# Altium project CAMERA_V100.PrjPcb
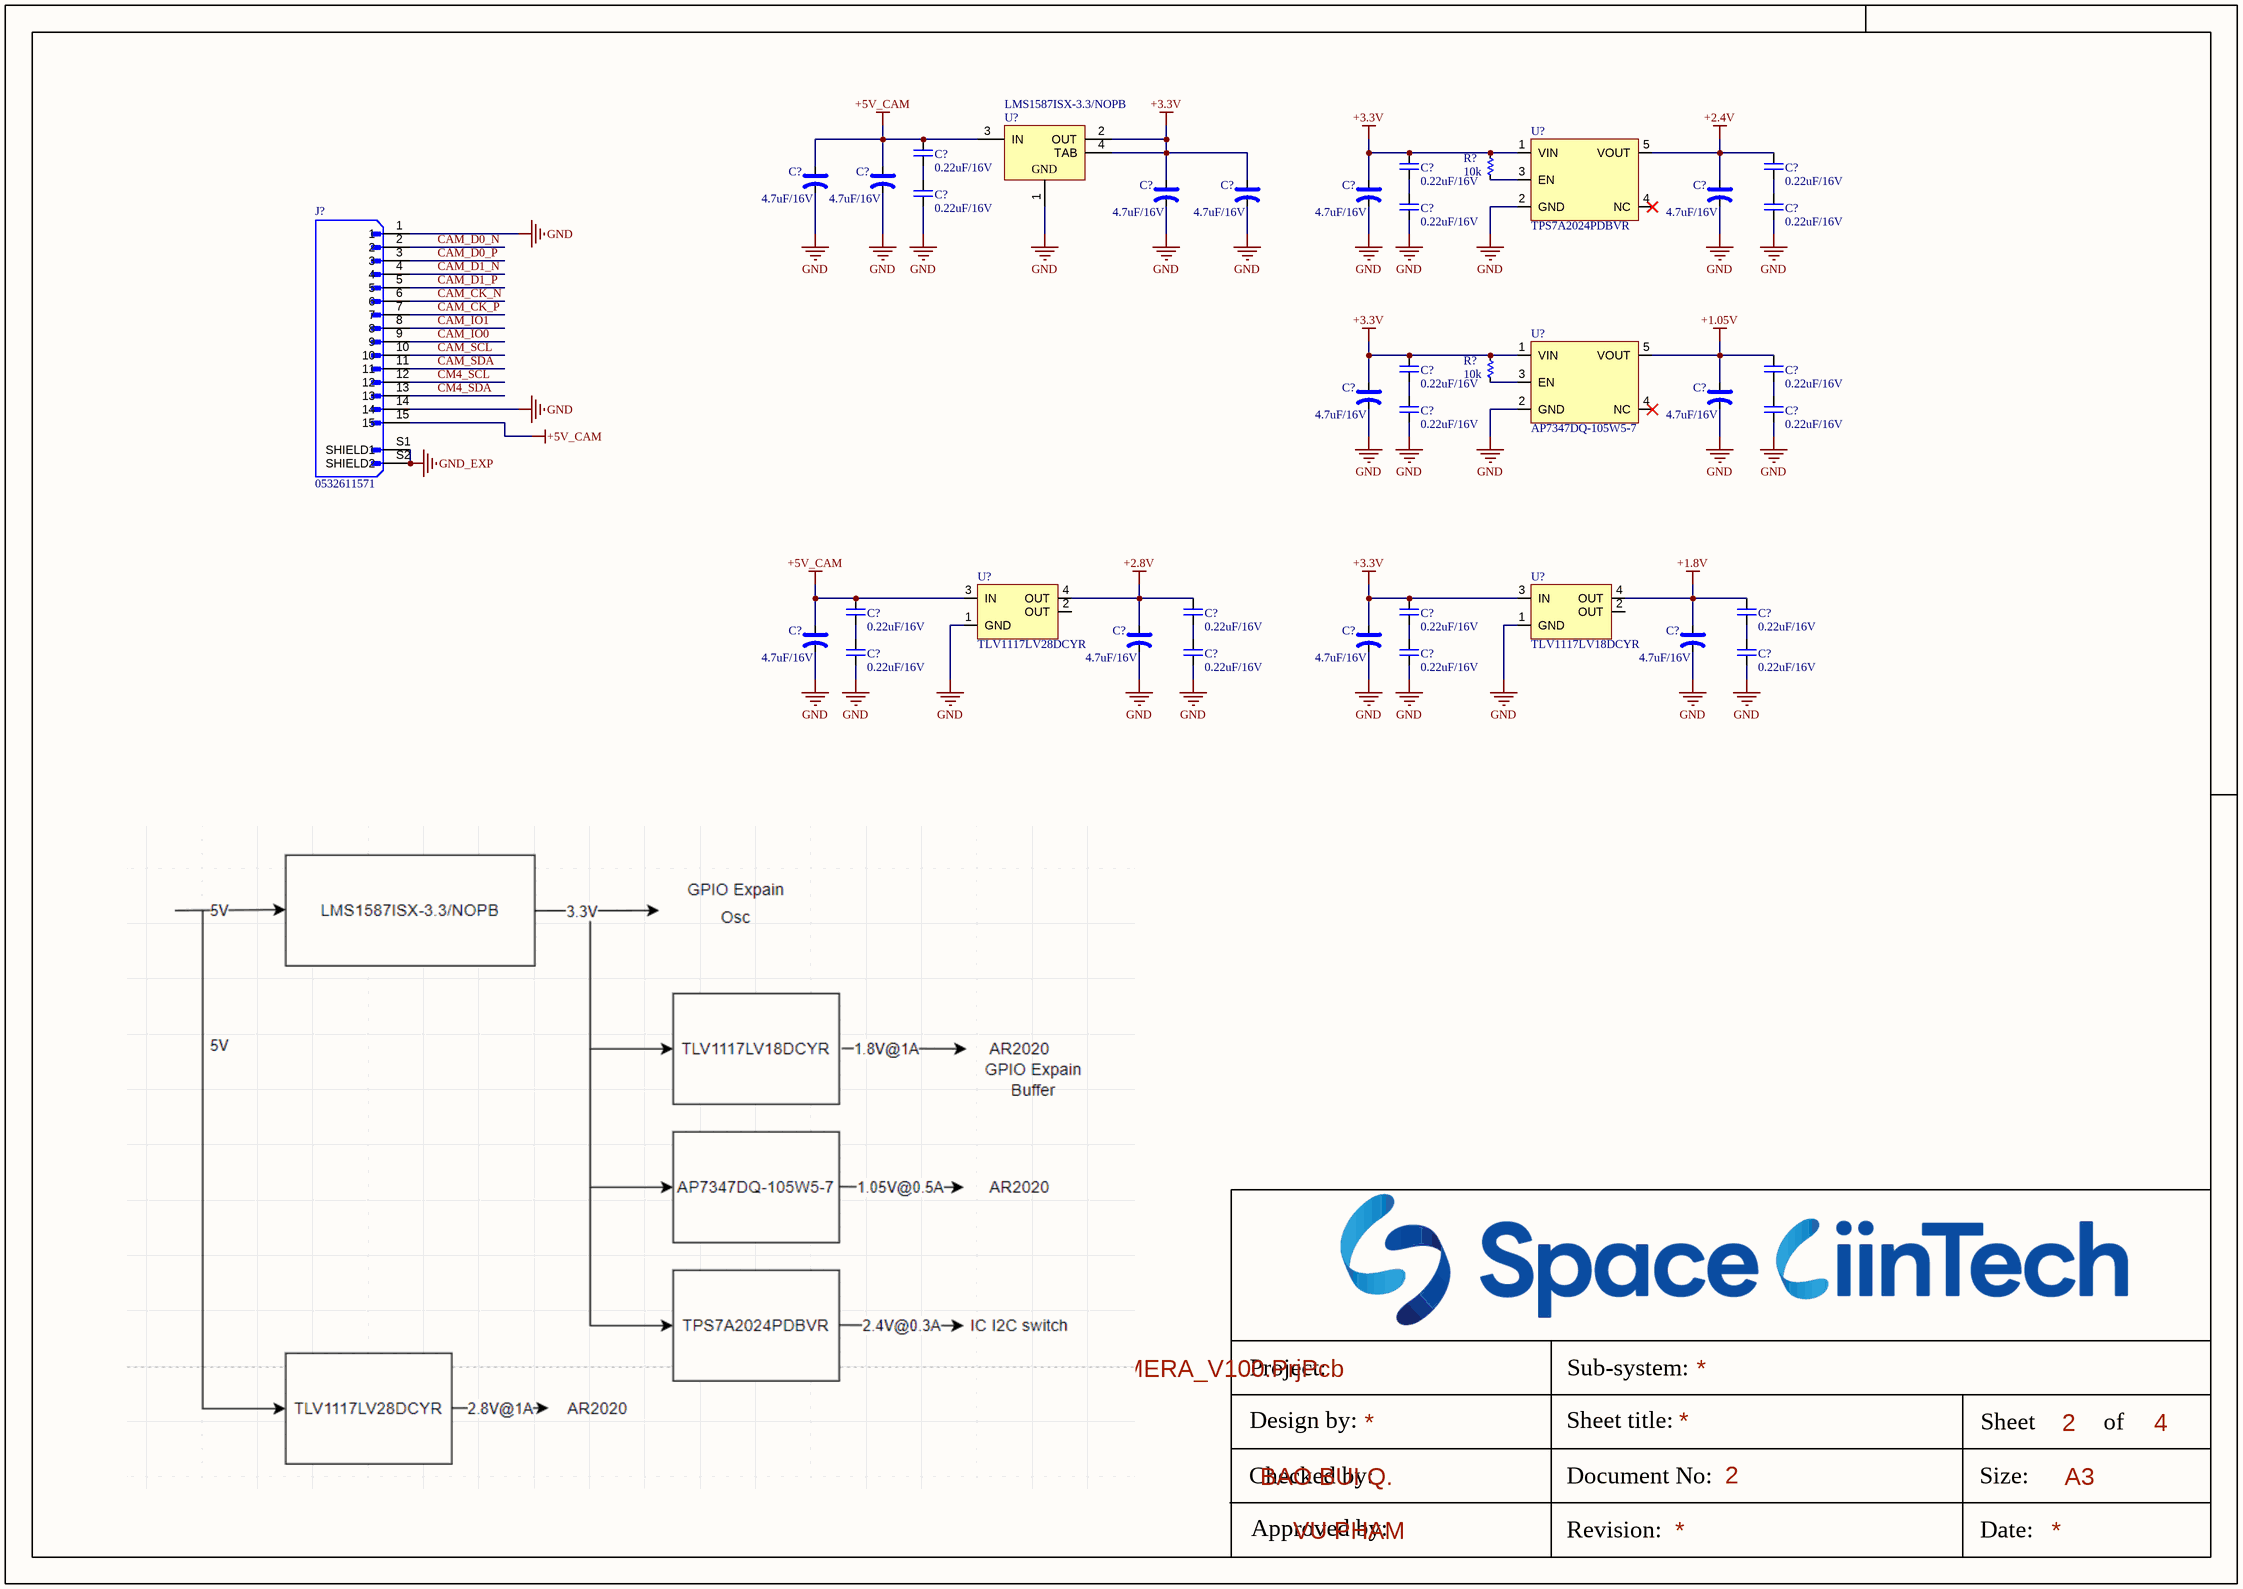
[diagram p0: CONNECTOR.SchDoc]
3 sheets, 167 parts. Net scope: global (net labels, ports and power ports of the same name join across sheets).
Board file: CAMERA_V100.PcbDoc
Sheets:
  CONNECTOR.SchDoc
  POWER.SchDoc
  SENSOR.SchDoc

## Sheet CONNECTOR.SchDoc
size 420 x 297 mm; SheetNumber: 2; SheetTotal: 4

### Parts
(Parts that share a designator on the sheet are numbered #1, #2 ... from top to bottom, then left to right.)
C?#1  0.22uF/16V
C?#2  0.22uF/16V
C?#3  0.22uF/16V
C?#4  4.7uF/16V
C?#5  4.7uF/16V
C?#6  0.22uF/16V
C?#7  4.7uF/16V
C?#8  4.7uF/16V
C?#9  4.7uF/16V
C?#10  4.7uF/16V
C?#11  0.22uF/16V
C?#12  0.22uF/16V
C?#13  0.22uF/16V
C?#14  0.22uF/16V
C?#15  4.7uF/16V
C?#16  4.7uF/16V
C?#17  0.22uF/16V
C?#18  0.22uF/16V
C?#19  0.22uF/16V
C?#20  0.22uF/16V
C?#21  0.22uF/16V
C?#22  0.22uF/16V
C?#23  4.7uF/16V
C?#24  4.7uF/16V
C?#25  4.7uF/16V
C?#26  4.7uF/16V
C?#27  0.22uF/16V
C?#28  0.22uF/16V
C?#29  0.22uF/16V
C?#30  0.22uF/16V
J?  0532611571  [0532611571]
R?#1  10k
R?#2  10k
U?#1  LMS1587ISX-3.3/NOPB  [TS3B_L]
U?#2  TPS7A2024PDBVR
U?#3  AP7347DQ-105W5-7
U?#4  TLV1117LV28DCYR
U?#5  TLV1117LV18DCYR

### Nets
+1.05V: C?#14.2 C?#16.1 U?#3.5(VOUT)
+1.8V: C?#22.2 C?#26.1 U?#5.4(OUT)
+2.4V: C?#3.2 C?#10.1 U?#2.5(VOUT)
+2.8V: C?#20.2 C?#24.1 U?#4.4(OUT)
+3.3V: C?#2.2 C?#7.1 C?#8.1 C?#9.1 C?#13.2 C?#15.1 C?#21.2 C?#25.1 R?#1.2 R?#2.2 U?#1.2(OUT) U?#1.4(TAB) U?#2.1(VIN) U?#3.1(VIN) U?#5.3(IN)
+5V_CAM: C?#1.2 C?#4.1 C?#5.1 C?#19.2 C?#23.1 J?.15 U?#1.3(IN) U?#4.3(IN)
GND: C?#4.2 C?#5.2 C?#6.1 C?#7.2 C?#8.2 C?#9.2 C?#10.2 C?#11.1 C?#12.1 C?#15.2 C?#16.2 C?#17.1 C?#18.1 C?#23.2 C?#24.2 C?#25.2 C?#26.2 C?#27.1 C?#28.1 C?#29.1 C?#30.1 J?.1 J?.14 U?#1.1(GND) U?#2.2(GND) U?#3.2(GND) U?#4.1(GND) U?#5.1(GND)
GND_EXP: J?.S1(SHIELD1) J?.S2(SHIELD2)
CAM_CK_N: J?.6
CAM_CK_P: J?.7
CAM_D0_N: J?.2
CAM_D0_P: J?.3
CAM_D1_N: J?.4
CAM_D1_P: J?.5
CAM_IO0: J?.9
CAM_IO1: J?.8
CAM_SCL: J?.10
CAM_SDA: J?.11
CM4_SCL: J?.12
CM4_SDA: J?.13
NetC?#1_1: C?#1.1 C?#6.2
NetC?#2_1: C?#2.1 C?#11.2
NetC?#3_1: C?#3.1 C?#12.2
NetC?#13_1: C?#13.1 C?#17.2
NetC?#14_1: C?#14.1 C?#18.2
NetC?#19_1: C?#19.1 C?#27.2
NetC?#20_1: C?#20.1 C?#28.2
NetC?#21_1: C?#21.1 C?#29.2
NetC?#22_1: C?#22.1 C?#30.2
NetR?#1_1: R?#1.1 U?#2.3(EN)
NetR?#2_1: R?#2.1 U?#3.3(EN)

Not connected (* = marked no-connect by the designer): U?#2 4(NC)*; U?#3 4(NC)*; U?#4 2(OUT); U?#5 2(OUT)

### Notes on the sheet
- Project:
- Sub-system:
- Design by:
- BAO BUI Q.
- Sheet title:
- Sheet
- A3
- of
- Checked by:
- Approved by:
- VU PHAM
- Revision:
- Document No:
- Size:
- Date:

### Library data of the parts
C?#1-C?#3 C?#6 C?#11-C?#14 C?#17-C?#22 C?#27-C?#30 = CAP_SMD: CAP_Chip; Value: 33pF
C?#4 C?#5 C?#7-C?#10 C?#15 C?#16 C?#23-C?#26 = CAP_TH: CAP_Polarization; Published: 8-Jun-2000; LatestRevisionDate: 17-Jul-2002; LatestRevisionNote: Re-released for DXP Platform.; PackageReference: POLAR0.8; Publisher: Altium Limited
J? = CONN_SMD_15: Conn Shrouded Header (4 Sides) HDR 15 POS 1.25mm Solder RA Side Entry SMD PicoBladeâ„¢ T/R; MF: Molex; Package: None; MP: 532611571; Check_prices: https://www.snapeda.com/parts/532611571/Molex/view-part/?ref=eda; Purchase-URL: https://pricing.snapeda.com/search/part/532611571/?ref=eda; Value: *; Availability: In Stock; Price: None; SnapEDA_Link: https://www.snapeda.com/parts/532611571/Molex/view-part/?ref=snap
R?#1 R?#2 = RES-SMD: RES-Chip; Manufacturer: Generic Components; Class: Passive; Published: 08/06/2000; Publisher: Altium Hobart Technology Centre
U?#1 = CMP-0062-00180-3: 3A Low Dropout Fast Response Regulators, 3-pin TO-263, Pb-Free; Manufacturer: National Semiconductor; PowerWise: N; High-Reliability: Y; PackageTopMarking: NSUZXYTTE#*LMS1587*IS-3.3; CompType: LDO IC; ComponentLink1Description: Manufacturer URL; PackageReference: TS3B; ComponentLink1URL: http://www.national.com/; ComponentLink2URL: http://www.national.com/ds/LM/LMS1587.pdf; DatasheetVersion: Jun-2005; ComponentLink3URL: http://www.national.com/pf/LM/LMS1587.html; PartNumber: LMS1587ISX-3.3/NOPB; RevisionNote: SCH symbol layout adjusted; PinCount: 3; RoHS: Y; Code_JEDEC: MO-169-AA; PackageDescription: TO-263, Molded, .400 x .390 x .180in, 3 Lead, .1in Pitch, Surface Mount; ComponentLink4Description: TS3B Package Page; ComponentLink3Description: LMS1587 Web Page; PackageVersion: revF, Apr-2005; ComponentLink2Description: LMS1587 Datasheet; ComponentLink4URL: http://www.national.com/packaging/folders/ts3b.html
U?#2 U?#3 = IC_POWER_AP7347DQ
U?#4 U?#5 = IC_POWER_TLV1117LV

## Sheet POWER.SchDoc
size 420 x 297 mm; SheetNumber: 3; SheetTotal: 4
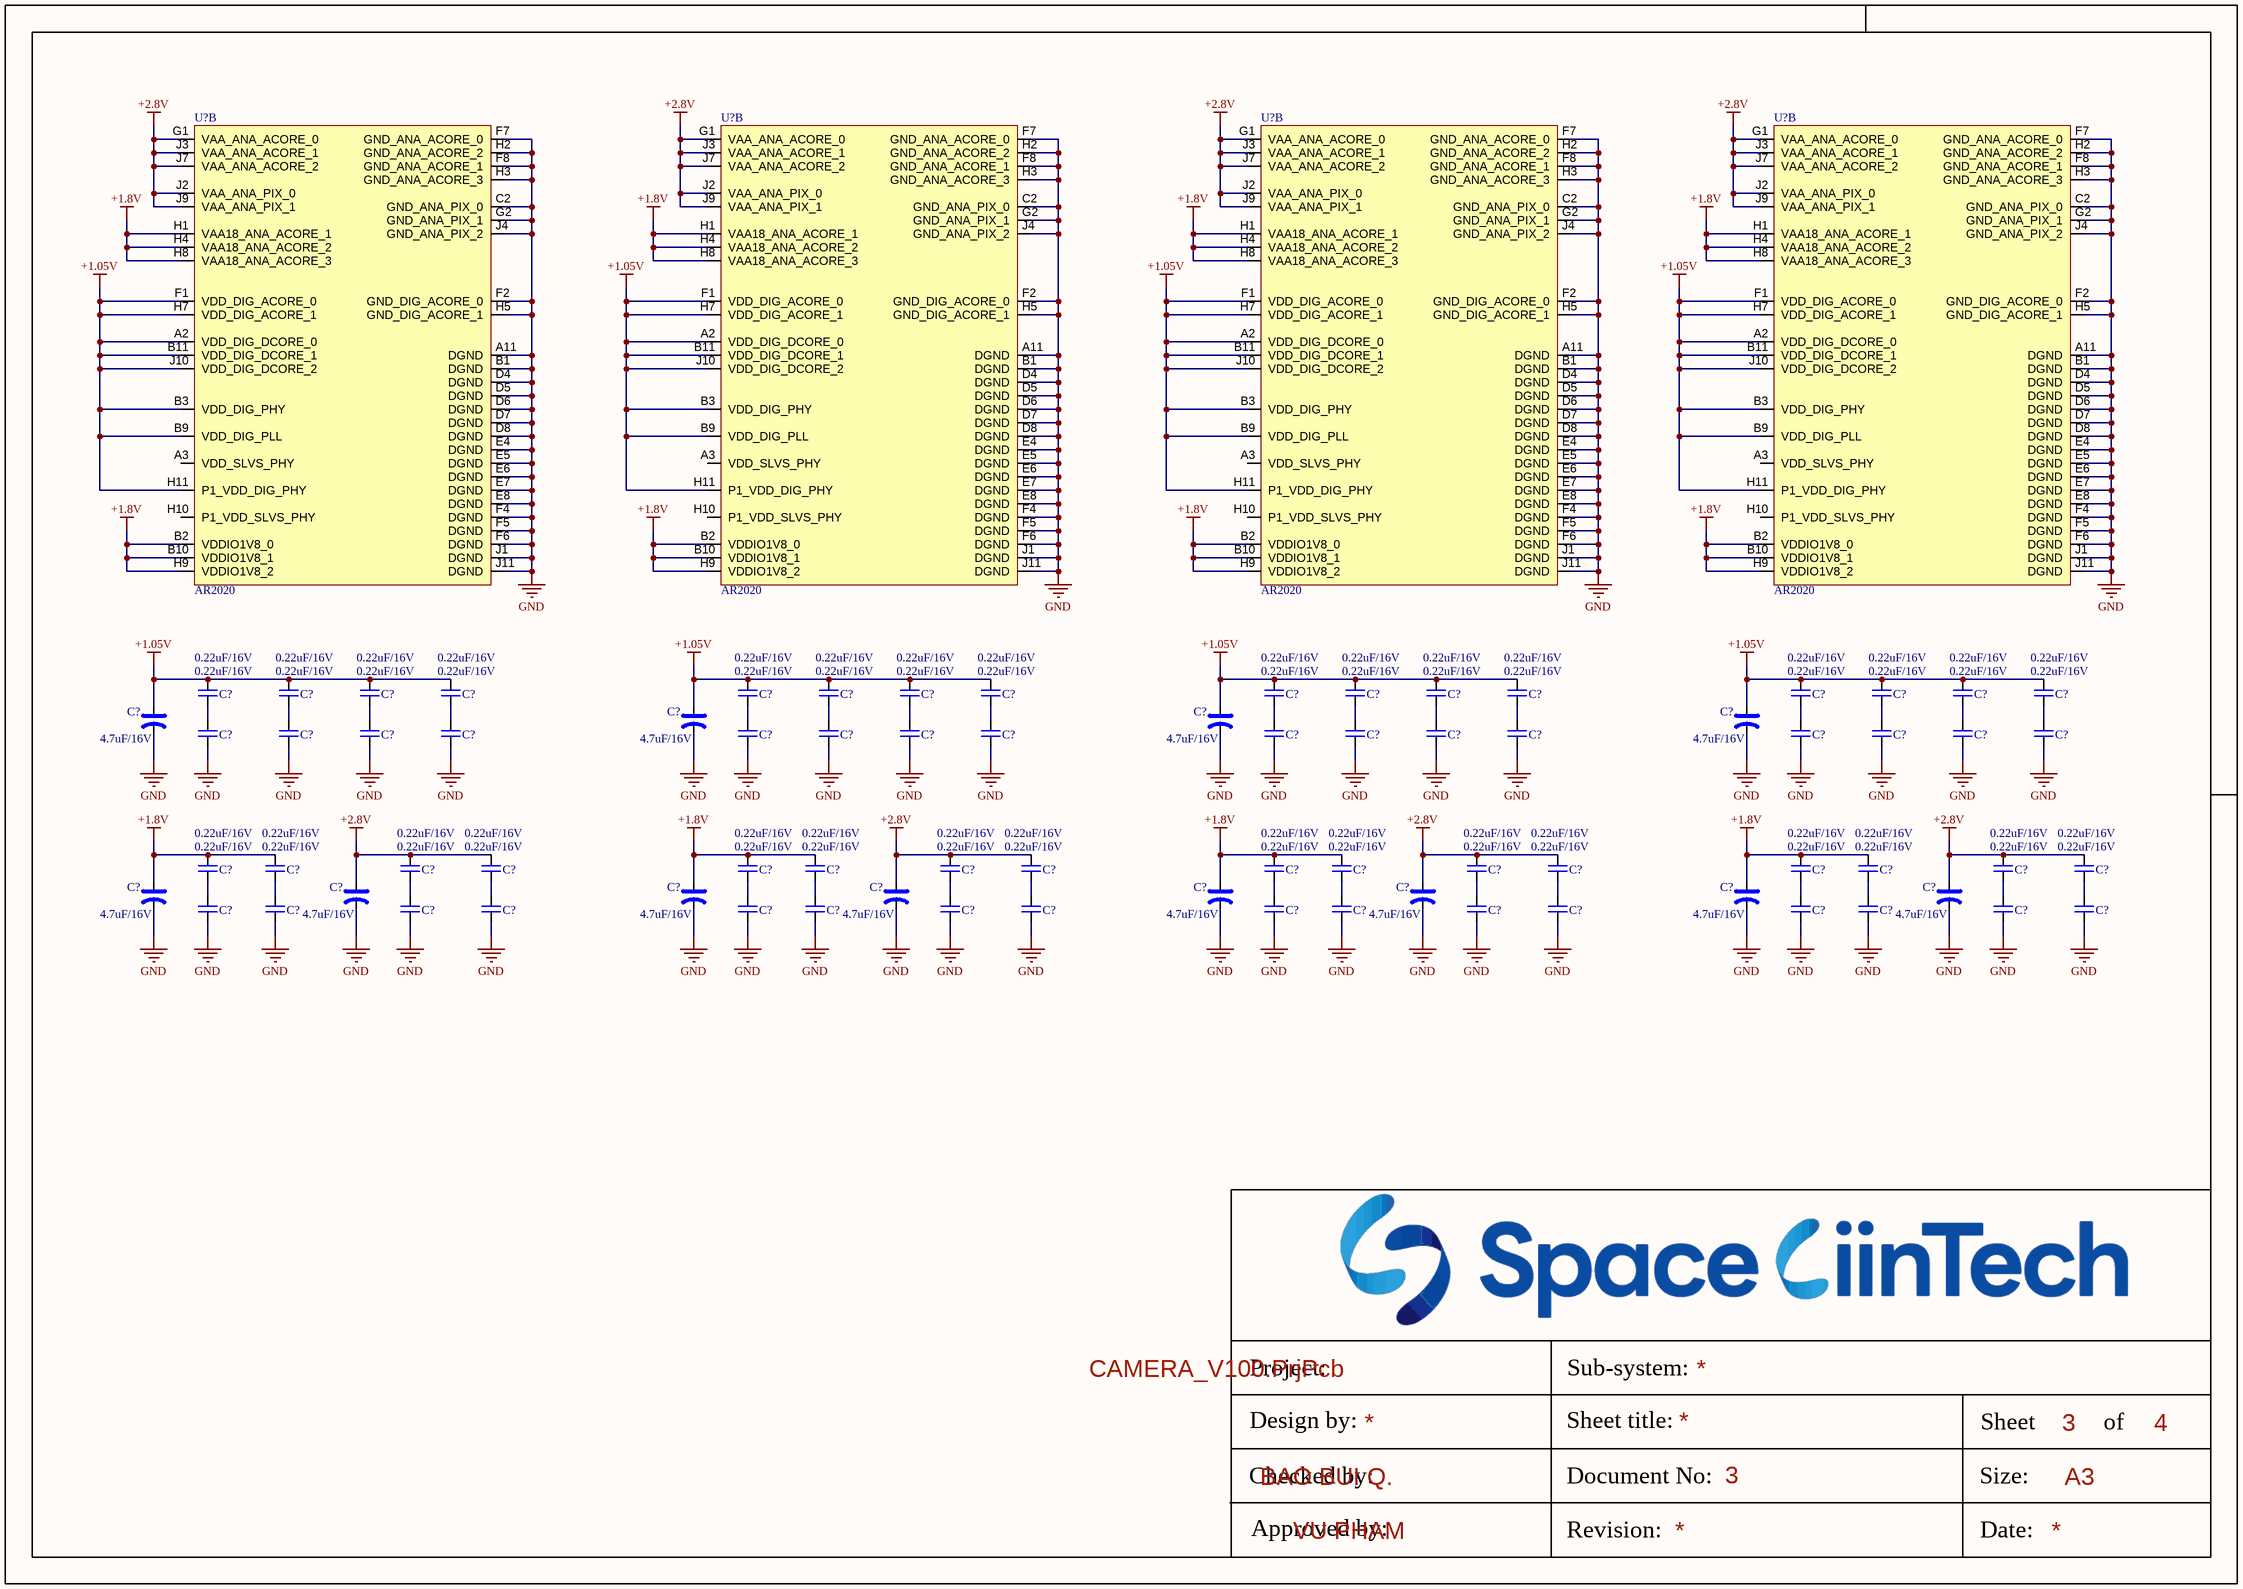
[diagram p1: POWER.SchDoc]

### Parts
(Parts that share a designator on the sheet are numbered #1, #2 ... from top to bottom, then left to right.)
C?#31  0.22uF/16V
C?#32  0.22uF/16V
C?#33  0.22uF/16V
C?#34  0.22uF/16V
C?#35  0.22uF/16V
C?#36  0.22uF/16V
C?#37  0.22uF/16V
C?#38  0.22uF/16V
C?#39  0.22uF/16V
C?#40  0.22uF/16V
C?#41  0.22uF/16V
C?#42  0.22uF/16V
C?#43  0.22uF/16V
C?#44  0.22uF/16V
C?#45  0.22uF/16V
C?#46  0.22uF/16V
C?#47  4.7uF/16V
C?#48  4.7uF/16V
C?#49  4.7uF/16V
C?#50  4.7uF/16V
C?#51  0.22uF/16V
C?#52  0.22uF/16V
C?#53  0.22uF/16V
C?#54  0.22uF/16V
C?#55  0.22uF/16V
C?#56  0.22uF/16V
C?#57  0.22uF/16V
C?#58  0.22uF/16V
C?#59  0.22uF/16V
C?#60  0.22uF/16V
C?#61  0.22uF/16V
C?#62  0.22uF/16V
C?#63  0.22uF/16V
C?#64  0.22uF/16V
C?#65  0.22uF/16V
C?#66  0.22uF/16V
C?#67  0.22uF/16V
C?#68  0.22uF/16V
C?#69  0.22uF/16V
C?#70  0.22uF/16V
C?#71  0.22uF/16V
C?#72  0.22uF/16V
C?#73  0.22uF/16V
C?#74  0.22uF/16V
C?#75  0.22uF/16V
C?#76  0.22uF/16V
C?#77  0.22uF/16V
C?#78  0.22uF/16V
C?#79  0.22uF/16V
C?#80  0.22uF/16V
C?#81  0.22uF/16V
C?#82  0.22uF/16V
C?#83  4.7uF/16V
C?#84  4.7uF/16V
C?#85  4.7uF/16V
C?#86  4.7uF/16V
C?#87  4.7uF/16V
C?#88  4.7uF/16V
C?#89  4.7uF/16V
C?#90  4.7uF/16V
C?#91  0.22uF/16V
C?#92  0.22uF/16V
C?#93  0.22uF/16V
C?#94  0.22uF/16V
C?#95  0.22uF/16V
C?#96  0.22uF/16V
C?#97  0.22uF/16V
C?#98  0.22uF/16V
C?#99  0.22uF/16V
C?#100  0.22uF/16V
C?#101  0.22uF/16V
C?#102  0.22uF/16V
C?#103  0.22uF/16V
C?#104  0.22uF/16V
C?#105  0.22uF/16V
C?#106  0.22uF/16V
U?#6  AR2020  (part B of 2)
U?#7  AR2020  (part B of 2)
U?#8  AR2020  (part B of 2)
U?#9  AR2020  (part B of 2)

### Nets
+1.05V: C?#31.2 C?#32.2 C?#33.2 C?#34.2 C?#35.2 C?#36.2 C?#37.2 C?#38.2 C?#39.2 C?#40.2 C?#41.2 C?#42.2 C?#43.2 C?#44.2 C?#45.2 C?#46.2 C?#47.1 C?#48.1 C?#49.1 C?#50.1 U?#6.A2(VDD_DIG_DCORE_0) U?#6.B3(VDD_DIG_PHY) U?#6.B9(VDD_DIG_PLL) U?#6.B11(VDD_DIG_DCORE_1) U?#6.F1(VDD_DIG_ACORE_0) U?#6.H7(VDD_DIG_ACORE_1) U?#6.H11(P1_VDD_DIG_PHY) U?#6.J10(VDD_DIG_DCORE_2) U?#7.A2(VDD_DIG_DCORE_0) U?#7.B3(VDD_DIG_PHY) U?#7.B9(VDD_DIG_PLL) U?#7.B11(VDD_DIG_DCORE_1) U?#7.F1(VDD_DIG_ACORE_0) U?#7.H7(VDD_DIG_ACORE_1) U?#7.H11(P1_VDD_DIG_PHY) U?#7.J10(VDD_DIG_DCORE_2) U?#8.A2(VDD_DIG_DCORE_0) U?#8.B3(VDD_DIG_PHY) U?#8.B9(VDD_DIG_PLL) U?#8.B11(VDD_DIG_DCORE_1) U?#8.F1(VDD_DIG_ACORE_0) U?#8.H7(VDD_DIG_ACORE_1) U?#8.H11(P1_VDD_DIG_PHY) U?#8.J10(VDD_DIG_DCORE_2) U?#9.A2(VDD_DIG_DCORE_0) U?#9.B3(VDD_DIG_PHY) U?#9.B9(VDD_DIG_PLL) U?#9.B11(VDD_DIG_DCORE_1) U?#9.F1(VDD_DIG_ACORE_0) U?#9.H7(VDD_DIG_ACORE_1) U?#9.H11(P1_VDD_DIG_PHY) U?#9.J10(VDD_DIG_DCORE_2)
+1.8V: C?#67.2 C?#68.2 C?#71.2 C?#72.2 C?#75.2 C?#76.2 C?#79.2 C?#80.2 C?#83.1 C?#85.1 C?#87.1 C?#89.1 U?#6.B2(VDDIO1V8_0) U?#6.B10(VDDIO1V8_1) U?#6.H1(VAA18_ANA_ACORE_1) U?#6.H4(VAA18_ANA_ACORE_2) U?#6.H8(VAA18_ANA_ACORE_3) U?#6.H9(VDDIO1V8_2) U?#7.B2(VDDIO1V8_0) U?#7.B10(VDDIO1V8_1) U?#7.H1(VAA18_ANA_ACORE_1) U?#7.H4(VAA18_ANA_ACORE_2) U?#7.H8(VAA18_ANA_ACORE_3) U?#7.H9(VDDIO1V8_2) U?#8.B2(VDDIO1V8_0) U?#8.B10(VDDIO1V8_1) U?#8.H1(VAA18_ANA_ACORE_1) U?#8.H4(VAA18_ANA_ACORE_2) U?#8.H8(VAA18_ANA_ACORE_3) U?#8.H9(VDDIO1V8_2) U?#9.B2(VDDIO1V8_0) U?#9.B10(VDDIO1V8_1) U?#9.H1(VAA18_ANA_ACORE_1) U?#9.H4(VAA18_ANA_ACORE_2) U?#9.H8(VAA18_ANA_ACORE_3) U?#9.H9(VDDIO1V8_2)
+2.8V: C?#69.2 C?#70.2 C?#73.2 C?#74.2 C?#77.2 C?#78.2 C?#81.2 C?#82.2 C?#84.1 C?#86.1 C?#88.1 C?#90.1 U?#6.G1(VAA_ANA_ACORE_0) U?#6.J2(VAA_ANA_PIX_0) U?#6.J3(VAA_ANA_ACORE_1) U?#6.J7(VAA_ANA_ACORE_2) U?#6.J9(VAA_ANA_PIX_1) U?#7.G1(VAA_ANA_ACORE_0) U?#7.J2(VAA_ANA_PIX_0) U?#7.J3(VAA_ANA_ACORE_1) U?#7.J7(VAA_ANA_ACORE_2) U?#7.J9(VAA_ANA_PIX_1) U?#8.G1(VAA_ANA_ACORE_0) U?#8.J2(VAA_ANA_PIX_0) U?#8.J3(VAA_ANA_ACORE_1) U?#8.J7(VAA_ANA_ACORE_2) U?#8.J9(VAA_ANA_PIX_1) U?#9.G1(VAA_ANA_ACORE_0) U?#9.J2(VAA_ANA_PIX_0) U?#9.J3(VAA_ANA_ACORE_1) U?#9.J7(VAA_ANA_ACORE_2) U?#9.J9(VAA_ANA_PIX_1)
GND: C?#47.2 C?#48.2 C?#49.2 C?#50.2 C?#51.1 C?#52.1 C?#53.1 C?#54.1 C?#55.1 C?#56.1 C?#57.1 C?#58.1 C?#59.1 C?#60.1 C?#61.1 C?#62.1 C?#63.1 C?#64.1 C?#65.1 C?#66.1 C?#83.2 C?#84.2 C?#85.2 C?#86.2 C?#87.2 C?#88.2 C?#89.2 C?#90.2 C?#91.1 C?#92.1 C?#93.1 C?#94.1 C?#95.1 C?#96.1 C?#97.1 C?#98.1 C?#99.1 C?#100.1 C?#101.1 C?#102.1 C?#103.1 C?#104.1 C?#105.1 C?#106.1 U?#6.A11(DGND) U?#6.B1(DGND) U?#6.C2(GND_ANA_PIX_0) U?#6.D4(DGND) U?#6.D5(DGND) U?#6.D6(DGND) U?#6.D7(DGND) U?#6.D8(DGND) U?#6.E4(DGND) U?#6.E5(DGND) U?#6.E6(DGND) U?#6.E7(DGND) U?#6.E8(DGND) U?#6.F2(GND_DIG_ACORE_0) U?#6.F4(DGND) U?#6.F5(DGND) U?#6.F6(DGND) U?#6.F7(GND_ANA_ACORE_0) U?#6.F8(GND_ANA_ACORE_1) U?#6.G2(GND_ANA_PIX_1) U?#6.H2(GND_ANA_ACORE_2) U?#6.H3(GND_ANA_ACORE_3) U?#6.H5(GND_DIG_ACORE_1) U?#6.J1(DGND) U?#6.J4(GND_ANA_PIX_2) U?#6.J11(DGND) U?#7.A11(DGND) U?#7.B1(DGND) U?#7.C2(GND_ANA_PIX_0) U?#7.D4(DGND) U?#7.D5(DGND) U?#7.D6(DGND) U?#7.D7(DGND) U?#7.D8(DGND) U?#7.E4(DGND) U?#7.E5(DGND) U?#7.E6(DGND) U?#7.E7(DGND) U?#7.E8(DGND) U?#7.F2(GND_DIG_ACORE_0) U?#7.F4(DGND) U?#7.F5(DGND) U?#7.F6(DGND) U?#7.F7(GND_ANA_ACORE_0) U?#7.F8(GND_ANA_ACORE_1) U?#7.G2(GND_ANA_PIX_1) U?#7.H2(GND_ANA_ACORE_2) U?#7.H3(GND_ANA_ACORE_3) U?#7.H5(GND_DIG_ACORE_1) U?#7.J1(DGND) U?#7.J4(GND_ANA_PIX_2) U?#7.J11(DGND) U?#8.A11(DGND) U?#8.B1(DGND) U?#8.C2(GND_ANA_PIX_0) U?#8.D4(DGND) U?#8.D5(DGND) U?#8.D6(DGND) U?#8.D7(DGND) U?#8.D8(DGND) U?#8.E4(DGND) U?#8.E5(DGND) U?#8.E6(DGND) U?#8.E7(DGND) U?#8.E8(DGND) U?#8.F2(GND_DIG_ACORE_0) U?#8.F4(DGND) U?#8.F5(DGND) U?#8.F6(DGND) U?#8.F7(GND_ANA_ACORE_0) U?#8.F8(GND_ANA_ACORE_1) U?#8.G2(GND_ANA_PIX_1) U?#8.H2(GND_ANA_ACORE_2) U?#8.H3(GND_ANA_ACORE_3) U?#8.H5(GND_DIG_ACORE_1) U?#8.J1(DGND) U?#8.J4(GND_ANA_PIX_2) U?#8.J11(DGND) U?#9.A11(DGND) U?#9.B1(DGND) U?#9.C2(GND_ANA_PIX_0) U?#9.D4(DGND) U?#9.D5(DGND) U?#9.D6(DGND) U?#9.D7(DGND) U?#9.D8(DGND) U?#9.E4(DGND) U?#9.E5(DGND) U?#9.E6(DGND) U?#9.E7(DGND) U?#9.E8(DGND) U?#9.F2(GND_DIG_ACORE_0) U?#9.F4(DGND) U?#9.F5(DGND) U?#9.F6(DGND) U?#9.F7(GND_ANA_ACORE_0) U?#9.F8(GND_ANA_ACORE_1) U?#9.G2(GND_ANA_PIX_1) U?#9.H2(GND_ANA_ACORE_2) U?#9.H3(GND_ANA_ACORE_3) U?#9.H5(GND_DIG_ACORE_1) U?#9.J1(DGND) U?#9.J4(GND_ANA_PIX_2) U?#9.J11(DGND)
NetC?#31_1: C?#31.1 C?#51.2
NetC?#32_1: C?#32.1 C?#52.2
NetC?#33_1: C?#33.1 C?#53.2
NetC?#34_1: C?#34.1 C?#54.2
NetC?#35_1: C?#35.1 C?#55.2
NetC?#36_1: C?#36.1 C?#56.2
NetC?#37_1: C?#37.1 C?#57.2
NetC?#38_1: C?#38.1 C?#58.2
NetC?#39_1: C?#39.1 C?#59.2
NetC?#40_1: C?#40.1 C?#60.2
NetC?#41_1: C?#41.1 C?#61.2
NetC?#42_1: C?#42.1 C?#62.2
NetC?#43_1: C?#43.1 C?#63.2
NetC?#44_1: C?#44.1 C?#64.2
NetC?#45_1: C?#45.1 C?#65.2
NetC?#46_1: C?#46.1 C?#66.2
NetC?#67_1: C?#67.1 C?#91.2
NetC?#68_1: C?#68.1 C?#92.2
NetC?#69_1: C?#69.1 C?#93.2
NetC?#70_1: C?#70.1 C?#94.2
NetC?#71_1: C?#71.1 C?#95.2
NetC?#72_1: C?#72.1 C?#96.2
NetC?#73_1: C?#73.1 C?#97.2
NetC?#74_1: C?#74.1 C?#98.2
NetC?#75_1: C?#75.1 C?#99.2
NetC?#76_1: C?#76.1 C?#100.2
NetC?#77_1: C?#77.1 C?#101.2
NetC?#78_1: C?#78.1 C?#102.2
NetC?#79_1: C?#79.1 C?#103.2
NetC?#80_1: C?#80.1 C?#104.2
NetC?#81_1: C?#81.1 C?#105.2
NetC?#82_1: C?#82.1 C?#106.2

Not connected (* = marked no-connect by the designer): U?#6 A3(VDD_SLVS_PHY) H10(P1_VDD_SLVS_PHY); U?#7 A3(VDD_SLVS_PHY) H10(P1_VDD_SLVS_PHY); U?#8 A3(VDD_SLVS_PHY) H10(P1_VDD_SLVS_PHY); U?#9 A3(VDD_SLVS_PHY) H10(P1_VDD_SLVS_PHY)

### Notes on the sheet
- Project:
- Sub-system:
- Design by:
- BAO BUI Q.
- Sheet title:
- Sheet
- A3
- of
- Checked by:
- Approved by:
- VU PHAM
- Revision:
- Document No:
- Size:
- Date:

### Library data of the parts
C?#31-C?#46 C?#51-C?#82 C?#91-C?#106 = CAP_SMD: CAP_Chip; Value: 33pF
C?#47-C?#50 C?#83-C?#90 = CAP_TH: CAP_Polarization; Published: 8-Jun-2000; LatestRevisionDate: 17-Jul-2002; LatestRevisionNote: Re-released for DXP Platform.; PackageReference: POLAR0.8; Publisher: Altium Limited

## Sheet SENSOR.SchDoc
size 420 x 297 mm; SheetNumber: 4; SheetTotal: 4
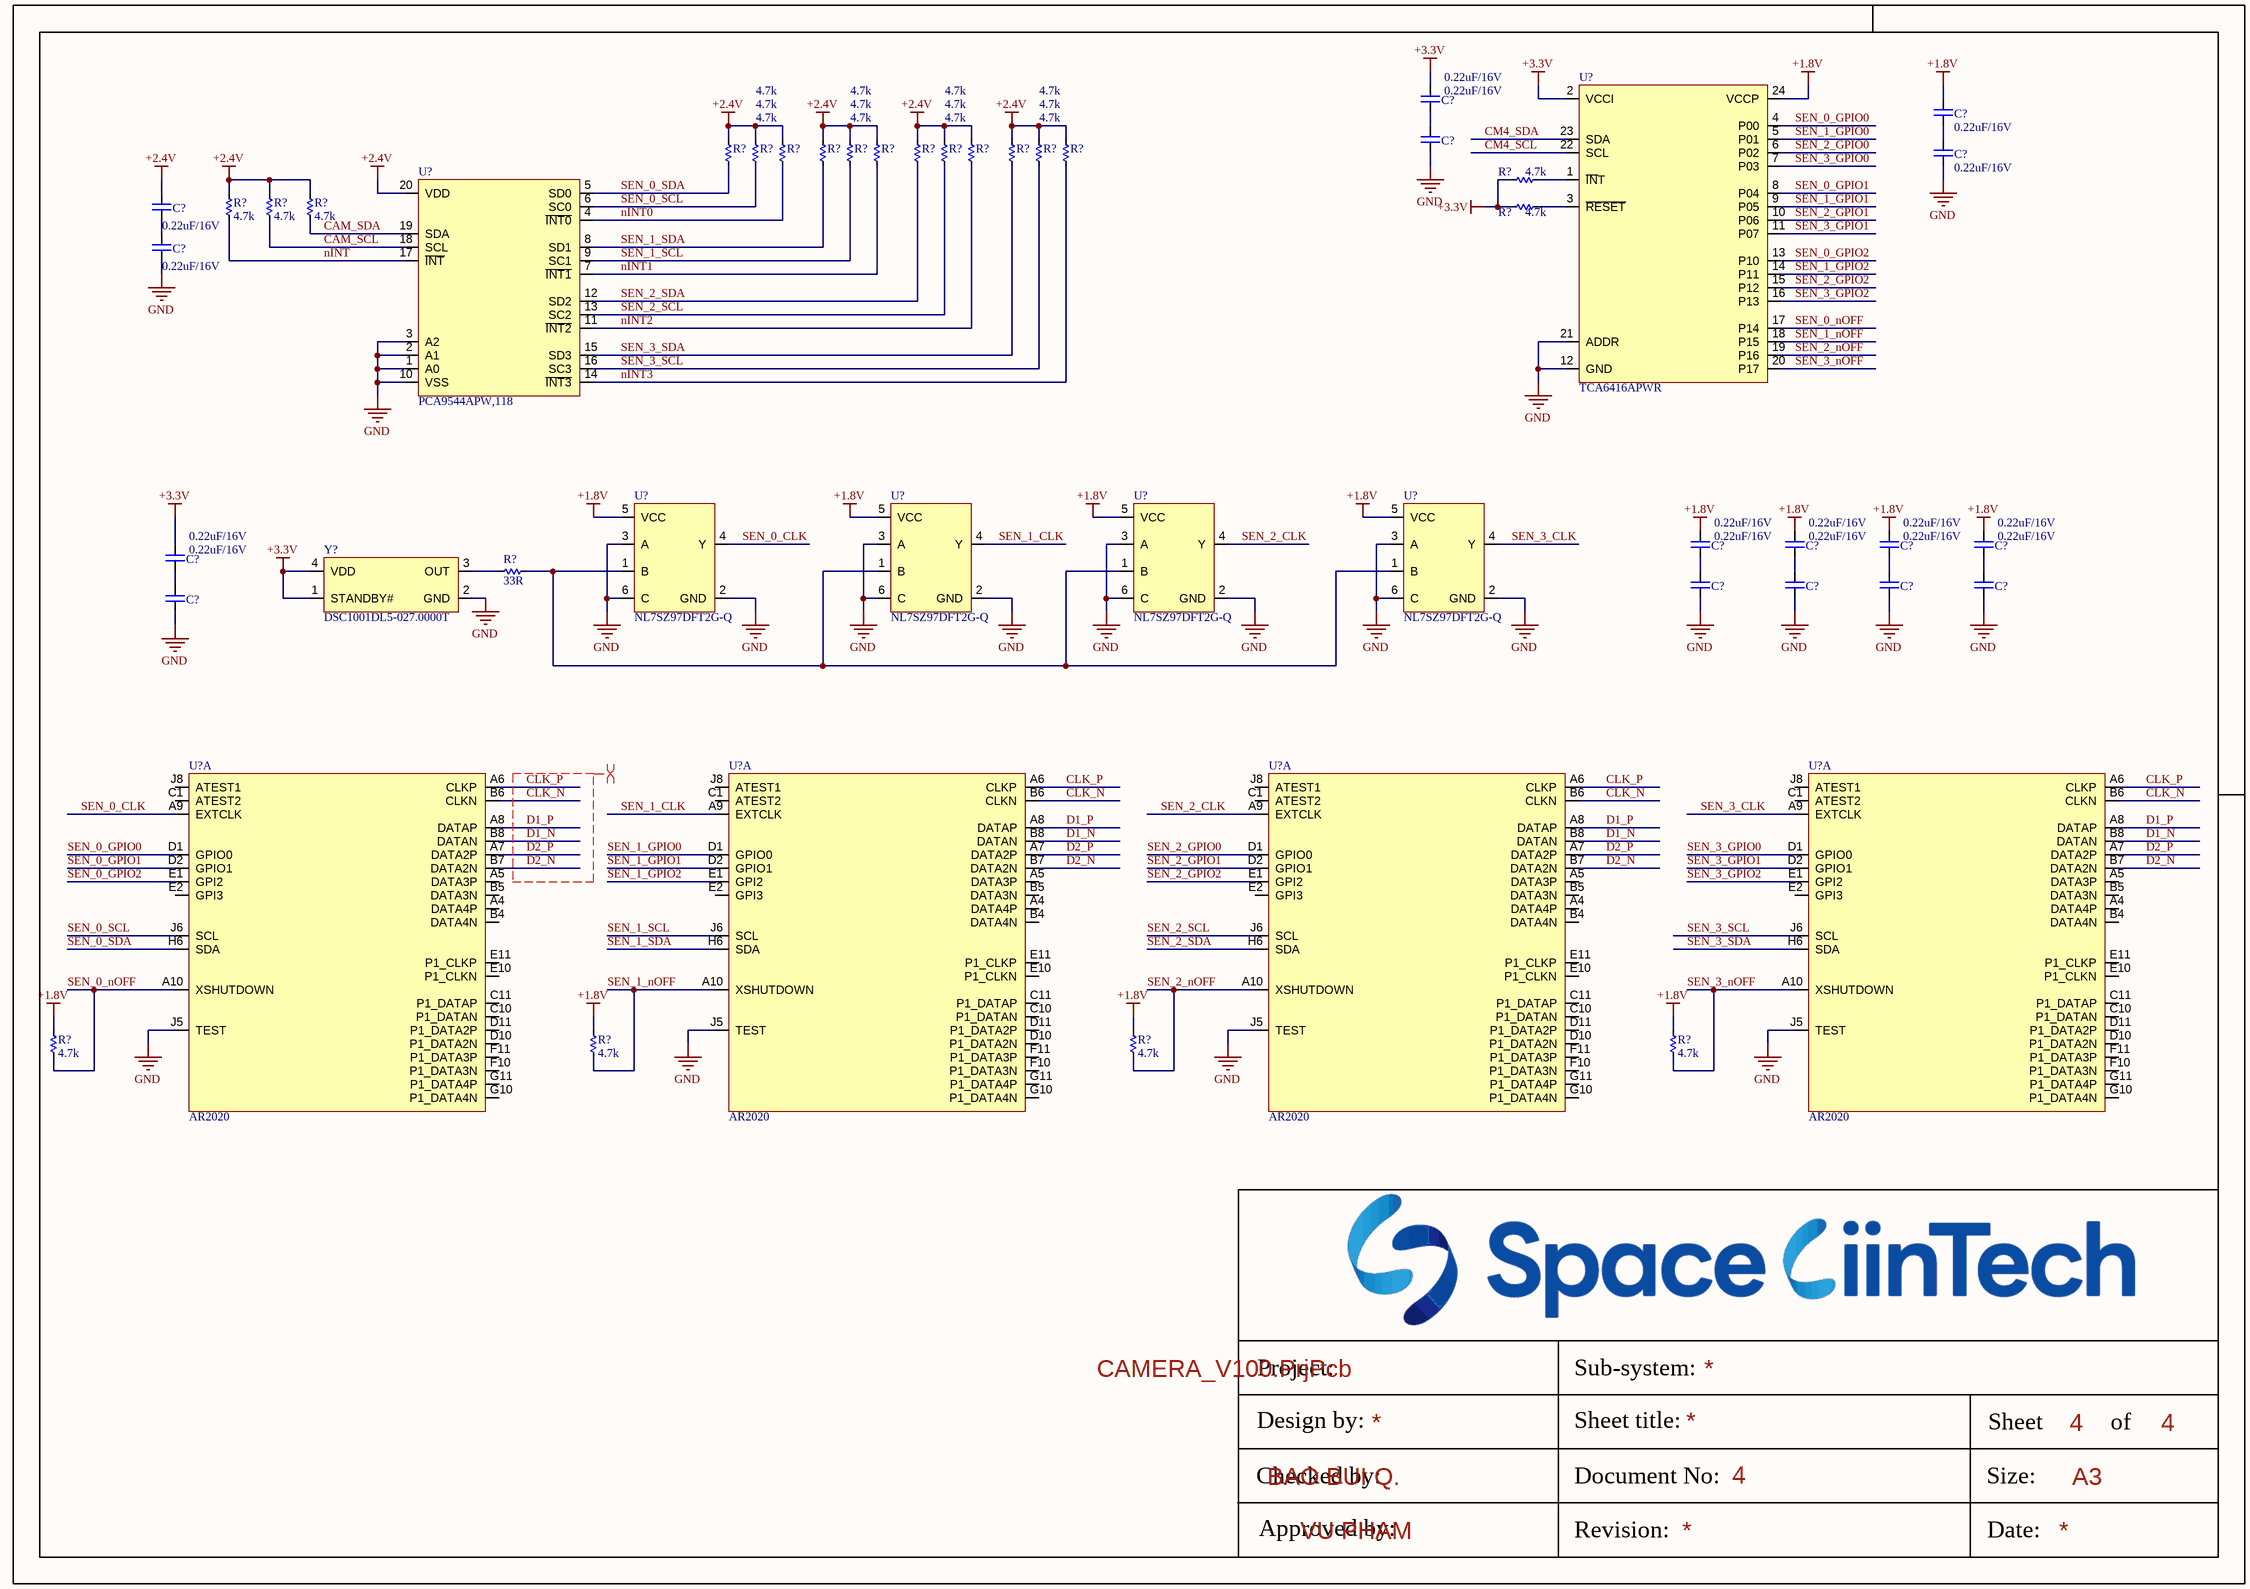
[diagram p2: SENSOR.SchDoc]

### Parts
(Parts that share a designator on the sheet are numbered #1, #2 ... from top to bottom, then left to right.)
C?#107  0.22uF/16V
C?#108  0.22uF/16V
C?#109  0.22uF/16V
C?#110  0.22uF/16V
C?#111  0.22uF/16V
C?#112  0.22uF/16V
C?#113  0.22uF/16V
C?#114  0.22uF/16V
C?#115  0.22uF/16V
C?#116  0.22uF/16V
C?#117  0.22uF/16V
C?#118  0.22uF/16V
C?#119  0.22uF/16V
C?#120  0.22uF/16V
C?#121  0.22uF/16V
C?#122  0.22uF/16V
R?#3  4.7k
R?#4  4.7k
R?#5  4.7k
R?#6  4.7k
R?#7  4.7k
R?#8  4.7k
R?#9  4.7k
R?#10  4.7k
R?#11  4.7k
R?#12  4.7k
R?#13  4.7k
R?#14  4.7k
R?#15  4.7k
R?#16  4.7k
R?#17  4.7k
R?#18  4.7k
R?#19  4.7k
R?#20  33R
R?#21  4.7k
R?#22  4.7k
R?#23  4.7k
R?#24  4.7k
U?#10  TCA6416APWR
U?#11  PCA9544APW,118
U?#12  NL7SZ97DFT2G-Q
U?#13  NL7SZ97DFT2G-Q
U?#14  NL7SZ97DFT2G-Q
U?#15  NL7SZ97DFT2G-Q
U?#16  AR2020  (part A of 2)
U?#17  AR2020  (part A of 2)
U?#18  AR2020  (part A of 2)
U?#19  AR2020  (part A of 2)
Y?  DSC1001DL5-027.0000T

### Nets
+1.8V: C?#108.2 C?#113.2 C?#114.2 C?#115.2 C?#116.2 R?#21.2 R?#22.2 R?#23.2 R?#24.2 U?#10.24(VCCP) U?#12.5(VCC) U?#13.5(VCC) U?#14.5(VCC) U?#15.5(VCC)
+2.4V: C?#111.2 R?#3.1 R?#4.1 R?#5.1 R?#6.1 R?#7.1 R?#8.1 R?#9.1 R?#10.1 R?#11.1 R?#12.1 R?#13.1 R?#14.1 R?#16.1 R?#17.1 R?#18.1 U?#11.20(VDD)
+3.3V: C?#107.2 C?#117.2 R?#15.1 R?#19.1 U?#10.2(VCCI) Y?.1(STANDBY#) Y?.4(VDD)
GND: C?#109.1 C?#110.1 C?#112.1 C?#118.1 C?#119.1 C?#120.1 C?#121.1 C?#122.1 U?#10.12(GND) U?#10.21(ADDR) U?#11.1(A0) U?#11.2(A1) U?#11.3(A2) U?#11.10(VSS) U?#12.2(GND) U?#12.3(A) U?#12.6(C) U?#13.2(GND) U?#13.3(A) U?#13.6(C) U?#14.2(GND) U?#14.3(A) U?#14.6(C) U?#15.2(GND) U?#15.3(A) U?#15.6(C) U?#16.J5(TEST) U?#17.J5(TEST) U?#18.J5(TEST) U?#19.J5(TEST) Y?.2(GND)
CAM_SCL: R?#17.2 U?#11.18(SCL)
CAM_SDA: R?#18.2 U?#11.19(SDA)
CLK_N: U?#16.B6(CLKN) U?#17.B6(CLKN) U?#18.B6(CLKN) U?#19.B6(CLKN)
CLK_P: U?#16.A6(CLKP) U?#17.A6(CLKP) U?#18.A6(CLKP) U?#19.A6(CLKP)
CM4_SCL: U?#10.22(SCL)
CM4_SDA: U?#10.23(SDA)
D1_N: U?#16.B8(DATAN) U?#17.B8(DATAN) U?#18.B8(DATAN) U?#19.B8(DATAN)
D1_P: U?#16.A8(DATAP) U?#17.A8(DATAP) U?#18.A8(DATAP) U?#19.A8(DATAP)
D2_N: U?#16.B7(DATA2N) U?#17.B7(DATA2N) U?#18.B7(DATA2N) U?#19.B7(DATA2N)
D2_P: U?#16.A7(DATA2P) U?#17.A7(DATA2P) U?#18.A7(DATA2P) U?#19.A7(DATA2P)
nINT: R?#16.2 U?#11.17(~{INT})
nINT0: R?#5.2 U?#11.4(~{INT0})
nINT1: R?#8.2 U?#11.7(~{INT1})
nINT2: R?#11.2 U?#11.11(~{INT2})
nINT3: R?#14.2 U?#11.14(~{INT3})
SEN_0_CLK: U?#12.4(Y) U?#16.A9(EXTCLK)
SEN_0_GPIO0: U?#10.4(P00) U?#16.D1(GPIO0)
SEN_0_GPIO1: U?#10.8(P04) U?#16.D2(GPIO1)
SEN_0_GPIO2: U?#10.13(P10) U?#16.E1(GPI2)
SEN_0_nOFF: R?#21.1 U?#10.17(P14) U?#16.A10(XSHUTDOWN)
SEN_0_SCL: R?#4.2 U?#11.6(SC0) U?#16.J6(SCL)
SEN_0_SDA: R?#3.2 U?#11.5(SD0) U?#16.H6(SDA)
SEN_1_CLK: U?#13.4(Y) U?#17.A9(EXTCLK)
SEN_1_GPIO0: U?#10.5(P01) U?#17.D1(GPIO0)
SEN_1_GPIO1: U?#10.9(P05) U?#17.D2(GPIO1)
SEN_1_GPIO2: U?#10.14(P11) U?#17.E1(GPI2)
SEN_1_nOFF: R?#22.1 U?#10.18(P15) U?#17.A10(XSHUTDOWN)
SEN_1_SCL: R?#7.2 U?#11.9(SC1) U?#17.J6(SCL)
SEN_1_SDA: R?#6.2 U?#11.8(SD1) U?#17.H6(SDA)
SEN_2_CLK: U?#14.4(Y) U?#18.A9(EXTCLK)
SEN_2_GPIO0: U?#10.6(P02) U?#18.D1(GPIO0)
SEN_2_GPIO1: U?#10.10(P06) U?#18.D2(GPIO1)
SEN_2_GPIO2: U?#10.15(P12) U?#18.E1(GPI2)
SEN_2_nOFF: R?#23.1 U?#10.19(P16) U?#18.A10(XSHUTDOWN)
SEN_2_SCL: R?#10.2 U?#11.13(SC2) U?#18.J6(SCL)
SEN_2_SDA: R?#9.2 U?#11.12(SD2) U?#18.H6(SDA)
SEN_3_CLK: U?#15.4(Y) U?#19.A9(EXTCLK)
SEN_3_GPIO0: U?#10.7(P03) U?#19.D1(GPIO0)
SEN_3_GPIO1: U?#10.11(P07) U?#19.D2(GPIO1)
SEN_3_GPIO2: U?#10.16(P13) U?#19.E1(GPI2)
SEN_3_nOFF: R?#24.1 U?#10.20(P17) U?#19.A10(XSHUTDOWN)
SEN_3_SCL: R?#13.2 U?#11.16(SC3) U?#19.J6(SCL)
SEN_3_SDA: R?#12.2 U?#11.15(SD3) U?#19.H6(SDA)
NetC?#107_1: C?#107.1 C?#109.2
NetC?#108_1: C?#108.1 C?#110.2
NetC?#111_1: C?#111.1 C?#112.2
NetC?#113_1: C?#113.1 C?#118.2
NetC?#114_1: C?#114.1 C?#119.2
NetC?#115_1: C?#115.1 C?#120.2
NetC?#116_1: C?#116.1 C?#121.2
NetC?#117_1: C?#117.1 C?#122.2
NetR?#15_2: R?#15.2 U?#10.1(~{IN}T)
NetR?#19_2: R?#19.2 U?#10.3(~{RESET})
NetR?#20_1: R?#20.1 U?#12.1(B) U?#13.1(B) U?#14.1(B) U?#15.1(B)
NetR?#20_2: R?#20.2 Y?.3(OUT)

Not connected (* = marked no-connect by the designer): U?#16 A4(DATA4P) A5(DATA3P) B4(DATA4N) B5(DATA3N) C1(ATEST2) C10(P1_DATAN) C11(P1_DATAP) D10(P1_DATA2N) D11(P1_DATA2P) E2(GPI3) E10(P1_CLKN) E11(P1_CLKP) F10(P1_DATA3N) F11(P1_DATA3P) G10(P1_DATA4N) G11(P1_DATA4P) J8(ATEST1); U?#17 A4(DATA4P) A5(DATA3P) B4(DATA4N) B5(DATA3N) C1(ATEST2) C10(P1_DATAN) C11(P1_DATAP) D10(P1_DATA2N) D11(P1_DATA2P) E2(GPI3) E10(P1_CLKN) E11(P1_CLKP) F10(P1_DATA3N) F11(P1_DATA3P) G10(P1_DATA4N) G11(P1_DATA4P) J8(ATEST1); U?#18 A4(DATA4P) A5(DATA3P) B4(DATA4N) B5(DATA3N) C1(ATEST2) C10(P1_DATAN) C11(P1_DATAP) D10(P1_DATA2N) D11(P1_DATA2P) E2(GPI3) E10(P1_CLKN) E11(P1_CLKP) F10(P1_DATA3N) F11(P1_DATA3P) G10(P1_DATA4N) G11(P1_DATA4P) J8(ATEST1); U?#19 A4(DATA4P) A5(DATA3P) B4(DATA4N) B5(DATA3N) C1(ATEST2) C10(P1_DATAN) C11(P1_DATAP) D10(P1_DATA2N) D11(P1_DATA2P) E2(GPI3) E10(P1_CLKN) E11(P1_CLKP) F10(P1_DATA3N) F11(P1_DATA3P) G10(P1_DATA4N) G11(P1_DATA4P) J8(ATEST1)

### Layout directives
differential pair; net class DIFF100: CLK_N, CLK_P, D1_N, D1_P, D2_N, D2_P

### Notes on the sheet
- Project:
- Sub-system:
- Design by:
- BAO BUI Q.
- Sheet title:
- Sheet
- A3
- of
- Checked by:
- Approved by:
- VU PHAM
- Revision:
- Document No:
- Size:
- Date:

### Library data of the parts
C?#107-C?#122 = CAP_SMD: CAP_Chip; Value: 33pF
R?#3-R?#24 = RES-SMD: as R?#1 on sheet CONNECTOR; Published: 08/06/2000; Publisher: Altium Hobart Technology Centre
U?#10 = IC_I2Cto16IO_TCA6416APWR
U?#11 = IC_I2CSW1to4_PCA9544APW,118
U?#12-U?#15 = IC_FLEXLOGIC_NL7SZ97DFT2G-Q
Y? = Y_OSC27MHz_DSC1001DL5-027.0000T

## Nets that join several sheets
+1.05V: CONNECTOR (C?#14.2 C?#16.1 U?#3.5), POWER (52 pins)
+1.8V: CONNECTOR (C?#22.2 C?#26.1 U?#5.4), POWER (36 pins), SENSOR (14 pins)
+2.4V: CONNECTOR (C?#3.2 C?#10.1 U?#2.5), SENSOR (17 pins)
+2.8V: CONNECTOR (C?#20.2 C?#24.1 U?#4.4), POWER (32 pins)
+3.3V: CONNECTOR (15 pins), SENSOR (7 pins)
GND: CONNECTOR (28 pins), POWER (148 pins), SENSOR (31 pins)
CAM_SCL: CONNECTOR (J?.10), SENSOR (R?#17.2 U?#11.18)
CAM_SDA: CONNECTOR (J?.11), SENSOR (R?#18.2 U?#11.19)
CM4_SCL: CONNECTOR (J?.12), SENSOR (U?#10.22)
CM4_SDA: CONNECTOR (J?.13), SENSOR (U?#10.23)